# EAGLE design San1.3B2 Work (EAGLE 6.1)
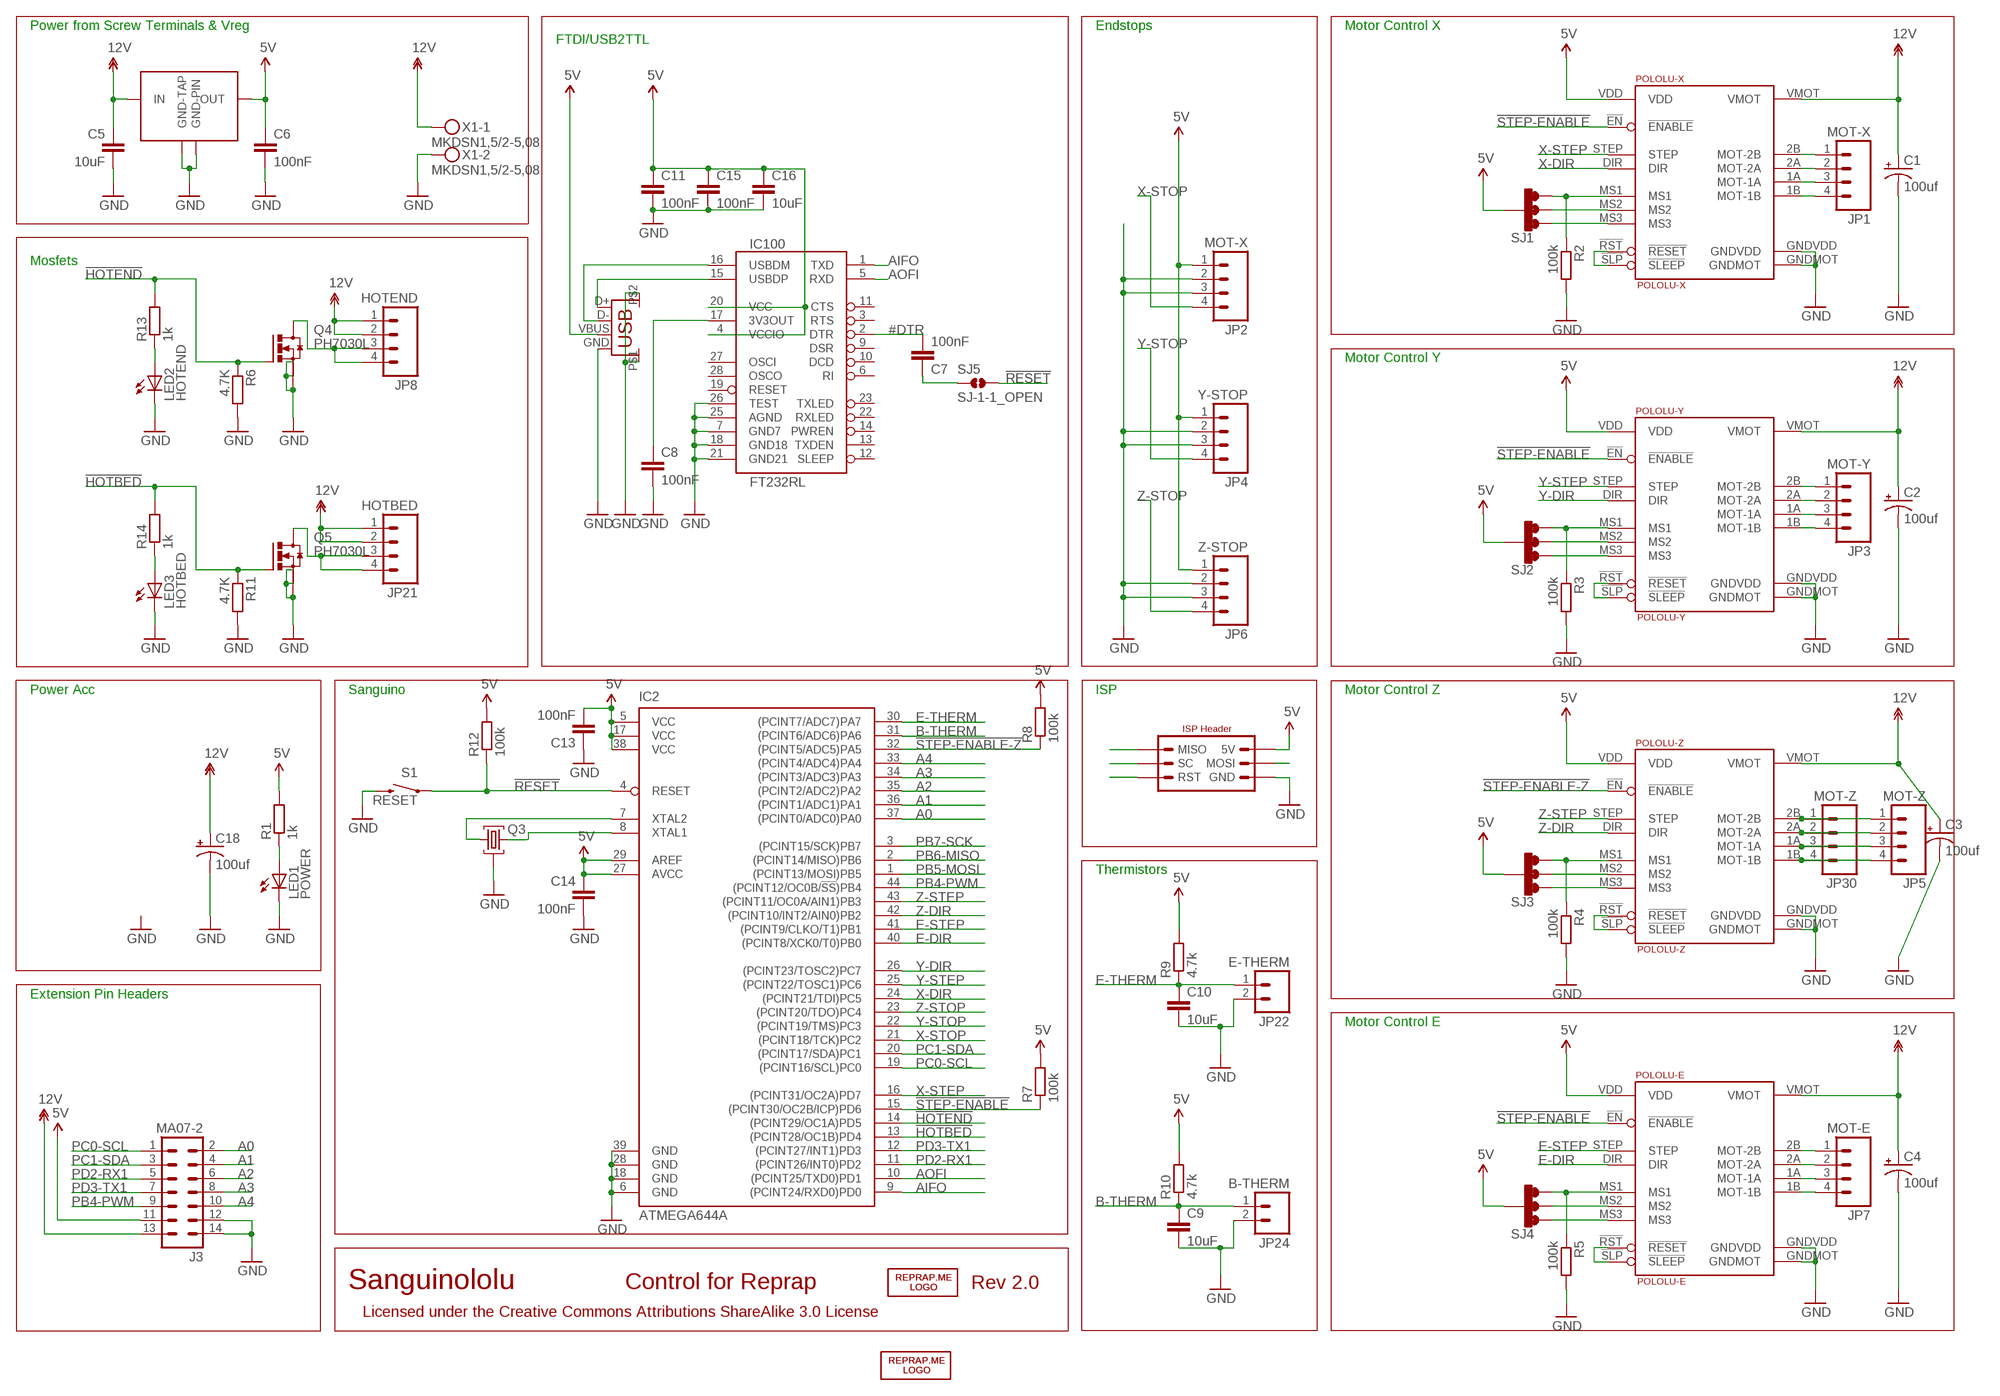
[diagram p0: schematic, sheet 1]

## Parts
C1  100uf  CAP_POLD  [PANASONIC_D]
C2  100uf  CAP_POLD  [PANASONIC_D]
C3  100uf  CAP_POLD  [PANASONIC_D]
C4  100uf  CAP_POLD  [PANASONIC_D]
C5  10uF  C-EU1206  [C1206]
C6  100nF  CAP0805  [0805]
C7  100nF  CAP0805  [0805]
C8  100nF  CAP0805  [0805]
C9  10uF  C-EU1206  [C1206]
C10  10uF  C-EU1206  [C1206]
C11  100nF  CAP0805  [0805]
C13  100nF  CAP0805  [0805]
C14  100nF  CAP0805  [0805]
C15  100nF  CAP0805  [0805]
C16  10uF  C-EU1206  [C1206]
C18  100uf  CAP_POLD  [PANASONIC_D]
IC1  V-REG+  [TO252+EXTRA-PIN]
IC2  ATMEGA644A  [TQFP44]
IC100  FT232RL  FT232RLSSOP  [SSOP28DB]
J1  USB  USBPTH  [USB-B-PTH]
J2  ISP-HEADER  [ISP-HEADER]
J3  MA07-2  [MA07-2]
JP1  MOT-X  M04POLAR  [MOLEX-1X4]
JP2  MOT-X  M04POLAR  [MOLEX-1X4]
JP3  MOT-Y  M04POLAR  [MOLEX-1X4]
JP4  Y-STOP  M04POLAR  [MOLEX-1X4]
JP5  MOT-Z  M04POLAR  [MOLEX-1X4]
JP6  Z-STOP  M04POLAR  [MOLEX-1X4]
JP7  MOT-E  M04POLAR  [MOLEX-1X4]
JP8  HOTEND  M04NO_THERMAL  [MOLEX-1X4_NO_THERMAL]
JP21  HOTBED  M04NO_THERMAL  [MOLEX-1X4_NO_THERMAL]
JP22  E-THERM  M02PTH  [1X02]
JP24  B-THERM  M02PTH  [1X02]
JP30  MOT-Z  M04POLAR  [MOLEX-1X4]
LED1  POWER  LEDCHIP-LED0805  [CHIP-LED0805]
LED2  HOTEND  LEDCHIP-LED0805  [CHIP-LED0805]
LED3  HOTBED  LEDCHIP-LED0805  [CHIP-LED0805]
LOGO1  REPRAP-LOGO6X100_BOTSILK  [REPRAP.ME_6X100_BOTSILK]
LOGO2  REPRAP-LOGO6X100_BOTSILK  [REPRAP.ME_6X100_BOTSILK]
LOGO3  REPRAP-LOGO6X100_TOPSILK  [REPRAP.ME_6X100_TOPSILK]
LOGO4  REPRAP-LOGO6X100_TOPSILK  [REPRAP.ME_6X100_TOPSILK]
POLOLU-E  POLOLU-E  POLOLU-ALLEGRO  [POLOLU-ALLEGRO-PTH]
POLOLU-X  POLOLU-X  POLOLU-ALLEGRO  [POLOLU-ALLEGRO-PTH]
POLOLU-Y  POLOLU-Y  POLOLU-ALLEGRO  [POLOLU-ALLEGRO-PTH]
POLOLU-Z  POLOLU-Z  POLOLU-ALLEGRO  [POLOLU-ALLEGRO-PTH]
Q3  AWSCR-CV  [AWSCR]
Q4  PH7030L  [SOT669-NO-THERMAL]
Q5  PH7030L  [SOT669-NO-THERMAL]
R1  1k  R-EU0805  [R0805]
R2  100k  R-EU0805  [R0805]
R3  100k  R-EU0805  [R0805]
R4  100k  R-EU0805  [R0805]
R5  100k  R-EU0805  [R0805]
R6  4.7K  R-EU0805  [R0805]
R7  100k  R-EU0805  [R0805]
R8  100k  R-EU0805  [R0805]
R9  4.7k  R-EU0805  [R0805]
R10  4.7k  R-EU0805  [R0805]
R11  4.7K  R-EU0805  [R0805]
R12  100k  R-EU0805  [R0805]
R13  1k  R-EU0805  [R0805]
R14  1k  R-EU0805  [R0805]
S1  RESET  SWITCH-MOMENTARY-2  [TACTILE_SWITCH_TALL]
SJ1  SJ-3  [SJ-3]
SJ2  SJ-3  [SJ-3]
SJ3  SJ-3  [SJ-3]
SJ4  SJ-3  [SJ-3]
SJ5  SJ-1-1_OPEN  [SJ-1-1_OPEN]
X1  MKDSN1,5/2-5,08  [MKDSN1,5/2-5,08]

## Nets
3V3: C8.1 IC100.17(3V3OUT)
5V [power]: C6.1 C11.1 C13.2 C14.1 C15.1 C16.1 IC1.2(OUT) IC2.5(VCC) IC2.17(VCC) IC2.27(AVCC) IC2.29(AREF) IC2.38(VCC) IC100.4(VCCIO) IC100.20(VCC) J1.VBUS J2.2(5V) J3.11 JP2.1 JP4.1 JP6.1 POLOLU-E.VDD POLOLU-X.VDD POLOLU-Y.VDD POLOLU-Z.VDD R1.2 R7.2 R8.2 R9.2 R10.2 R12.2 SJ1.4(COMMON) SJ2.4(COMMON) SJ3.4(COMMON) SJ4.4(COMMON)
12V [power]: C1.+ C2.+ C3.+ C4.+ C5.1 C18.+ IC1.1(IN) J3.13 JP8.1 JP8.2 JP21.1 JP21.2 POLOLU-E.VMOT POLOLU-X.VMOT POLOLU-Y.VMOT POLOLU-Z.VMOT X1.1
!FTDI-RESET: C7.1 SJ5.1
!HOTBED: IC2.13((PCINT28/OC1B)PD4) Q5.4(G) R11.1 R14.2
!HOTEND: IC2.14((PCINT29/OC1A)PD5) Q4.4(G) R6.1 R13.2
!RESET: IC2.4(RESET) J2.5(RST) R12.1 S1.A2 SJ5.2
!STEP-ENABLE: IC2.15((PCINT30/OC2B/ICP)PD6) POLOLU-E.!EN(!ENABLE) POLOLU-X.!EN(!ENABLE) POLOLU-Y.!EN(!ENABLE) R7.1
!STEP-ENABLE-Z: IC2.32((PCINT5/ADC5)PA5) POLOLU-Z.!EN(!ENABLE) R8.1
#DTR: C7.2 IC100.2(DTR)
A0: IC2.37((PCINT0/ADC0)PA0) J3.2
A1: IC2.36((PCINT1/ADC1)PA1) J3.4
A2: IC2.35((PCINT2/ADC2)PA2) J3.6
A3: IC2.34((PCINT3/ADC3)PA3) J3.8
A4: IC2.33((PCINT4/ADC4)PA4) J3.10
AIFO: IC2.9((PCINT24/RXD0)PD0) IC100.1(TXD)
AOFI: IC2.10((PCINT25/TXD0)PD1) IC100.5(RXD)
B-THERM: C9.1 IC2.31((PCINT6/ADC6)PA6) JP24.1 R10.1
E-DIR: IC2.40((PCINT8/XCK0/T0)PB0) POLOLU-E.DIR
E-MOT-1A [power]: JP7.3 POLOLU-E.1A(MOT-1A)
E-MOT-1B [power]: JP7.4 POLOLU-E.1B(MOT-1B)
E-MOT-2A [power]: JP7.2 POLOLU-E.2A(MOT-2A)
E-MOT-2B [power]: JP7.1 POLOLU-E.2B(MOT-2B)
E-MS1: POLOLU-E.MS1 R5.1 SJ4.3
E-MS2: POLOLU-E.MS2 SJ4.2
E-MS3: POLOLU-E.MS3 SJ4.1
E-RESETSLEEP: POLOLU-E.!RST(!RESET) POLOLU-E.!SLP(!SLEEP)
E-STEP: IC2.41((PCINT9/CLKO/T1)PB1) POLOLU-E.STEP
E-THERM: C10.1 IC2.30((PCINT7/ADC7)PA7) JP22.1 R9.1
GND [power]: C1.- C2.- C3.- C4.- C5.2 C6.2 C8.2 C9.2 C10.2 C11.2 C13.1 C14.2 C15.2 C16.2 C18.- IC1.3(GND-TAP) IC1.4(GND-PIN) IC2.6(GND) IC2.18(GND) IC2.28(GND) IC2.39(GND) IC100.7(GND7) IC100.18(GND18) IC100.21(GND21) IC100.25(AGND) IC100.26(TEST) J1.GND J1.P$1 J1.P$2 J2.6(GND) J3.12 J3.14 JP2.2 JP2.3 JP4.2 JP4.3 JP6.2 JP6.3 JP22.2 JP24.2 LED1.C LED2.C LED3.C POLOLU-E.GNDMOT POLOLU-E.GNDVDD POLOLU-X.GNDMOT POLOLU-X.GNDVDD POLOLU-Y.GNDMOT POLOLU-Y.GNDVDD POLOLU-Z.GNDMOT POLOLU-Z.GNDVDD Q3.GND Q4.1(S) Q4.2(S) Q4.3(S) Q5.1(S) Q5.2(S) Q5.3(S) R2.2 R3.2 R4.2 R5.2 R6.2 R11.2 S1.B2 X1.2
HOTBED-GND [power]: JP21.3 JP21.4 Q5.MB(D)
HOTEND-GND [power]: JP8.3 JP8.4 Q4.MB(D)
LED1: LED1.A R1.1
LED2: LED2.A R13.1
LED3: LED3.A R14.1
N$2: IC2.8(XTAL1) Q3.IN
N$3: IC2.7(XTAL2) Q3.OUT
PB4-PWM: IC2.44((PCINT12/OC0B/!SS!)PB4) J3.9
PB5-MOSI: IC2.1((PCINT13/MOSI)PB5) J2.4(MOSI)
PB6-MISO: IC2.2((PCINT14/MISO)PB6) J2.1(MISO)
PB7-SCK: IC2.3((PCINT15/SCK)PB7) J2.3(SC)
PC0-SCL: IC2.19((PCINT16/SCL)PC0) J3.1
PC1-SDA: IC2.20((PCINT17/SDA)PC1) J3.3
PD2-RX1: IC2.11((PCINT26/INT0)PD2) J3.5
PD3-TX1: IC2.12((PCINT27/INT1)PD3) J3.7
USBDM: IC100.16(USBDM) J1.D-
USBDP: IC100.15(USBDP) J1.D+
X-DIR: IC2.24((PCINT21/TDI)PC5) POLOLU-X.DIR
X-MOT-1A [power]: JP1.3 POLOLU-X.1A(MOT-1A)
X-MOT-1B [power]: JP1.4 POLOLU-X.1B(MOT-1B)
X-MOT-2A [power]: JP1.2 POLOLU-X.2A(MOT-2A)
X-MOT-2B [power]: JP1.1 POLOLU-X.2B(MOT-2B)
X-MS1: POLOLU-X.MS1 R2.1 SJ1.3
X-MS2: POLOLU-X.MS2 SJ1.2
X-MS3: POLOLU-X.MS3 SJ1.1
X-RESETSLEEP: POLOLU-X.!RST(!RESET) POLOLU-X.!SLP(!SLEEP)
X-STEP: IC2.16((PCINT31/OC2A)PD7) POLOLU-X.STEP
X-STOP: IC2.21((PCINT18/TCK)PC2) JP2.4
Y-DIR: IC2.26((PCINT23/TOSC2)PC7) POLOLU-Y.DIR
Y-MOT-1A [power]: JP3.3 POLOLU-Y.1A(MOT-1A)
Y-MOT-1B [power]: JP3.4 POLOLU-Y.1B(MOT-1B)
Y-MOT-2A [power]: JP3.2 POLOLU-Y.2A(MOT-2A)
Y-MOT-2B [power]: JP3.1 POLOLU-Y.2B(MOT-2B)
Y-MS1: POLOLU-Y.MS1 R3.1 SJ2.3
Y-MS2: POLOLU-Y.MS2 SJ2.2
Y-MS3: POLOLU-Y.MS3 SJ2.1
Y-RESETSLEEP: POLOLU-Y.!RST(!RESET) POLOLU-Y.!SLP(!SLEEP)
Y-STEP: IC2.25((PCINT22/TOSC1)PC6) POLOLU-Y.STEP
Y-STOP: IC2.22((PCINT19/TMS)PC3) JP4.4
Z-DIR: IC2.42((PCINT10/INT2/AIN0)PB2) POLOLU-Z.DIR
Z-MOT-1A [power]: JP5.3 JP30.3 POLOLU-Z.1A(MOT-1A)
Z-MOT-1B [power]: JP5.4 JP30.4 POLOLU-Z.1B(MOT-1B)
Z-MOT-2A [power]: JP5.2 JP30.2 POLOLU-Z.2A(MOT-2A)
Z-MOT-2B [power]: JP5.1 JP30.1 POLOLU-Z.2B(MOT-2B)
Z-MS1: POLOLU-Z.MS1 R4.1 SJ3.3
Z-MS2: POLOLU-Z.MS2 SJ3.2
Z-MS3: POLOLU-Z.MS3 SJ3.1
Z-RESETSLEEP: POLOLU-Z.!RST(!RESET) POLOLU-Z.!SLP(!SLEEP)
Z-STEP: IC2.43((PCINT11/OC0A/AIN1)PB3) POLOLU-Z.STEP
Z-STOP: IC2.23((PCINT20/TDO)PC4) JP6.4
Unconnected: IC100.3(RTS) IC100.6(RI) IC100.9(DSR) IC100.10(DCD) IC100.11(CTS) IC100.12(SLEEP) IC100.13(TXDEN) IC100.14(PWREN) IC100.19(RESET) IC100.22(RXLED) IC100.23(TXLED) IC100.27(OSCI) IC100.28(OSCO)

## Notes on the sheet
- Power from Screw Terminals & Vreg | Endstops | Motor Control X
- FTDI/USB2TTL
- Mosfets
- Motor Control Y
- Power Acc | Sanguino | ISP | Motor Control Z
- Thermistors
- Extension Pin Headers
- Motor Control E
- Sanguinololu | Control for Reprap | Rev 2.0
- Licensed under the Creative Commons Attributions ShareAlike 3.0 License

## Library data of the parts
C1-C4 C18 = SparkFun:CAP_POL: Capacitor Polarized These are standard SMD and PTH capacitors. Normally 10uF, 47uF, and 100uF in electrolytic and tantalum varieties. Always verify the external diameter of the through hole cap, it varies with capacity, voltage, and manufacturer. The EIA devices should be standard.
C5 C9 C10 C16 = REPRAP_ME:C-EU
C6-C8 C11 C13-C15 = SparkFun:CAP: Capacitor Standard 0603 ceramic capacitor, and 0.1" leaded capacitor.
IC1 = REPRAP_ME:V-REG+
IC2 = atmel:ATMEGA644: 8-bit Microcontroller with 64K Bytes In-System Programmable Flash Source: http://www.atmel.com/dyn/resources/prod_documents/doc2593.pdf; MPN: ATMEGA644PV-10AU; OC_FARNELL: 1455123; OC_NEWARK: 58M3748
IC100 = SparkFun:FT232RL: USB UART FT232RL 4th Generation USB UART (USB <-> Serial) Controller. Spark Fun Electronics SKU : COM-00650
J1 = SparkFun:USB: USB Connectors USB-B-PTH is fully proven SKU : PRT-00139 USB-miniB is fully proven SKU : PRT-00587 USB-A-PCB is untested. USB-A-H is throughly reviewed, but untested. Spark Fun Electronics SKU : PRT-00437 USB-B-SMT is throughly reviewed, but untested. Needs silkscreen touching up. USB-A-S has not been used/tested USB-MB-H has not been used/tested
J2 = REPRAP_ME:ISP-HEADER: PIN HEADER; OC_FARNELL: unknown; OC_NEWARK: unknown
J3 = Header Male:MA07-2: PIN HEADER; OC_FARNELL: unknown; OC_NEWARK: unknown
JP1-JP7 JP30 = SparkFun:M04: Header 4 Standard 4-pin 0.1" header. Use with straight break away headers (SKU : PRT-00116), right angle break away headers (PRT-00553), swiss pins (PRT-00743), machine pins (PRT-00117), and female headers (PRT-00115). Molex polarized connector foot print use with SKU : PRT-08231 with associated ...
JP8 JP21 = REPRAP_ME:M04: Header 4 Standard 4-pin 0.1" header. Use with straight break away headers (SKU : PRT-00116), right angle break away headers (PRT-00553), swiss pins (PRT-00743), machine pins (PRT-00117), and female headers (PRT-00115). Molex polarized connector foot print use with SKU : PRT-08231 with associated ...
JP22 JP24 = SparkFun:M02: Header 2 Standard 2-pin 0.1" header. Use with straight break away headers (SKU : PRT-00116), right angle break away headers (PRT-00553), swiss pins (PRT-00743), machine pins (PRT-00117), and female headers (PRT-00115). Molex polarized connector foot print use with SKU : PRT-08233 with associated crimp pins and housings.
LED1-LED3 = led:LED: LED OSRAM: - CHIPLED LG R971, LG N971, LY N971, LG Q971, LY Q971, LO R971, LY R971 LH N974, LH R974 LS Q976, LO Q976, LY Q976 LO Q996 - Hyper CHIPLED LW Q18S LB Q993, LB Q99A, LB R99A - SideLED LS A670, LO A670, LY A670, LG A670, LP A670 LB A673, LV A673, LT A673, LW A673 LH A674 LY A675 LS A676, LA A676, LO A676, LY A676, LW A676 LS A679, LY A679, LG A679 - Hyper Micro SIDELED® LS Y876, LA Y876, LO Y876, LY Y876 LT Y87S - SmartLED LW L88C, LW L88S LB L89C, LB L89S, LG L890 LS L89K, LO L89K, LY L89K LS L896, LA L896, LO L896, LY L896 - TOPLED LS T670, LO T670, LY T670, LG T670, LP T670 LSG T670, LSP T670, LSY T670, LOP T670, LYG T670 LG T671, LOG T671, LSG T671 LB T673, LV T673, LT T673, LW T673 LH T674 LS T676, LA T676, LO T676, LY T676, LB T676, LH T676, LSB T676, LW T676 LB T67C, LV T67C, LT T67C, LS T67K, LO T67K, LY T67K, LW E67C LS E67B, LA E67B, LO E67B, LY E67B, LB E67C, LV E67C, LT E67C LW T67C LS T679, LY T679, LG T679 LS T770, LO T770, LY T770, LG T770, LP T770 LB T773, LV T773, LT T773, LW T773 LH T774 LS E675, LA E675, LY E675, LS T675 LS T776, LA T776, LO T776, LY T776, LB T776 LHGB T686 LT T68C, LB T68C - Hyper Mini TOPLED® LB M676 - Mini TOPLED Santana® LG M470 LS M47K, LO M47K, LY M47K Source: http://www.osram.convergy.de LUXEON: - LUMILED® LXK2-PW12-R00, LXK2-PW12-S00, LXK2-PW14-U00, LXK2-PW14-V00 LXK2-PM12-R00, LXK2-PM12-S00, LXK2-PM14-U00 LXK2-PE12-Q00, LXK2-PE12-R00, LXK2-PE12-S00, LXK2-PE14-T00, LXK2-PE14-U00 LXK2-PB12-K00, LXK2-PB12-L00, LXK2-PB12-M00, LXK2-PB14-N00, LXK2-PB14-P00, LXK2-PB14-Q00 LXK2-PR12-L00, LXK2-PR12-M00, LXK2-PR14-Q00, LXK2-PR14-R00 LXK2-PD12-Q00, LXK2-PD12-R00, LXK2-PD12-S00 LXK2-PH12-R00, LXK2-PH12-S00 LXK2-PL12-P00, LXK2-PL12-Q00, LXK2-PL12-R00 Source: www.luxeon.com KINGBRIGHT: KA-3528ASYC Source: www.kingbright.com
LOGO1-LOGO4 = REPRAP_ME:REPRAP-LOGO
POLOLU-E POLOLU-X POLOLU-Y POLOLU-Z = pololu-allegro:POLOLU-ALLEGRO
Q3 = REPRAP_ME:AWSCR-CV
Q4 Q5 = REPRAP_ME:PH7030L: N-channel TrenchMOS (TM) logic level FET Source: http://www.nxp.com/acrobat_download/datasheets/PH7030L_4.pdf
R1-R14 = REPRAP_ME:R-EU
S1 = printrbot:SWITCH-MOMENTARY-2
SJ1-SJ4 = REPRAP_ME:SJ-3: SMD solder JUMPER
SJ5 = REPRAP_ME:SJ-1-1_OPEN
X1 = con-phoenix-508:MKDSN1,5/2-5,08: MKDSN 1,5/ 2-5,08 Printklemme Nennstrom: 13,5 A Nennspannung: 250 V Rastermaß: 5,08 mm Polzahl: 2 Anschlussart: Schraubanschluss Montage: Löten Anschlussrichtung Leiter/Platine: 0 ° Artikelnummer: 1729128 Source: http://eshop.phoenixcontact.com .. 1729128.pdf; MPN: MKDSN 1,5/2-5.08; OC_FARNELL: 1792903; OC_NEWARK: 30M2397

## Net classes
1 power: width 1.27 mm

## Board
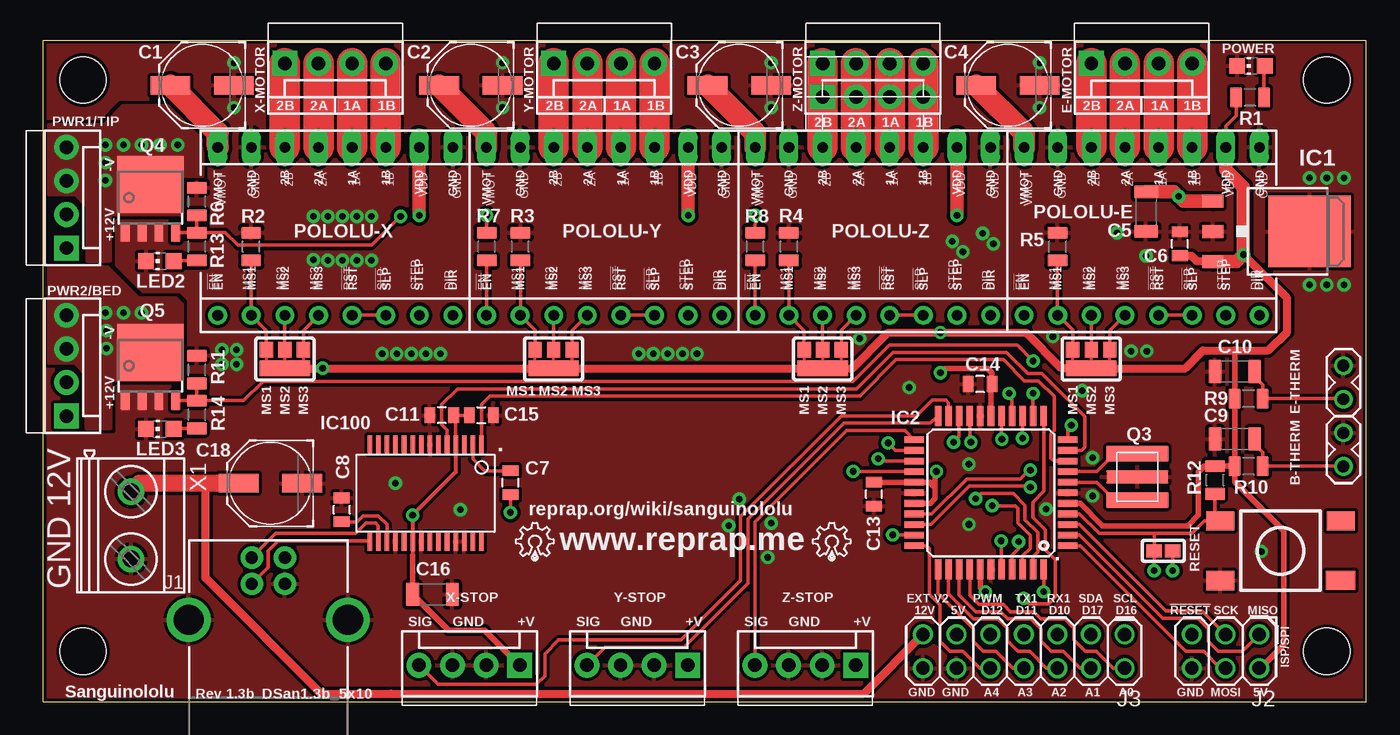
[diagram p1: board, top side]
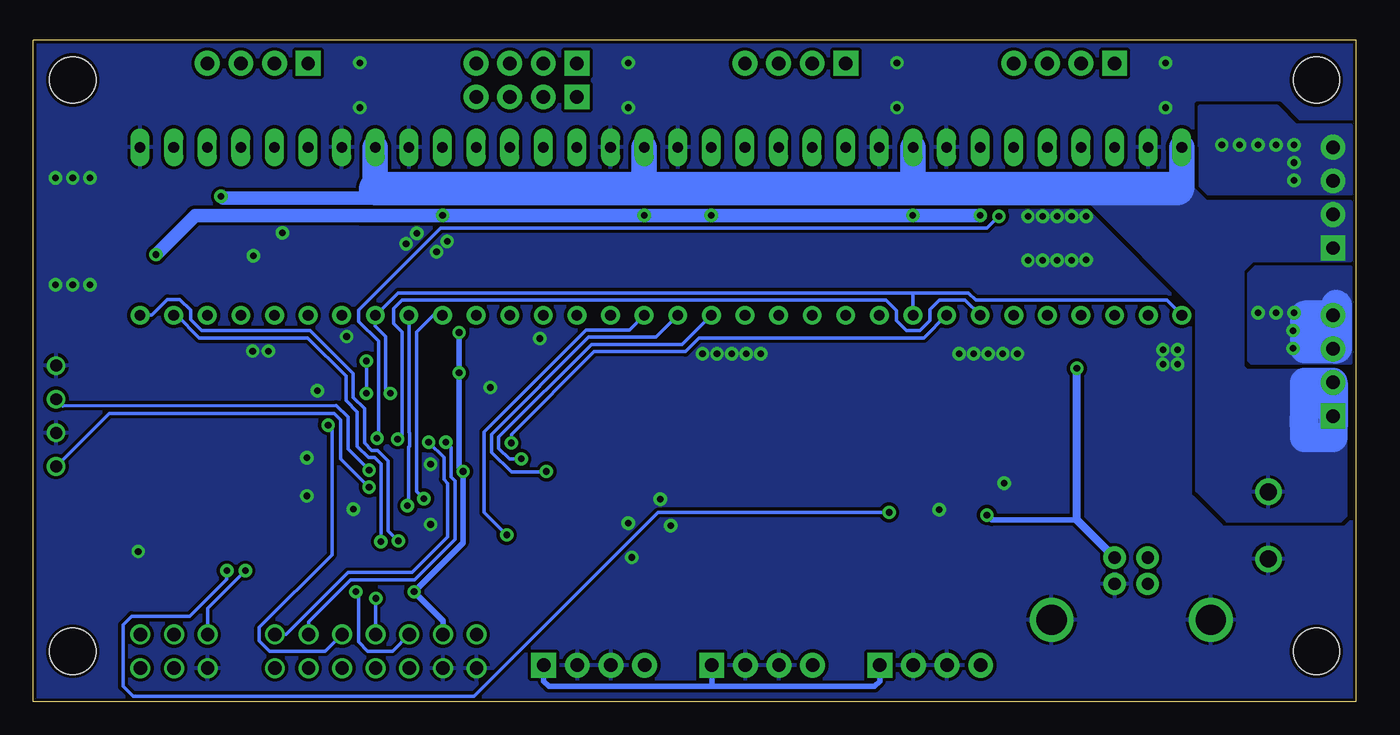
[diagram p2: board, bottom side, seen from below]

Size 100 x 50 mm. Coordinates in mm from the lower left corner, seen from the top.
Outline: 0,0 0,50 100,50 100,0 0,0
Copper layers (1*16): Top 0.035mm / dielectric 1.5mm / Bottom 0.035mm
Design rules "default": minimum track width 10mil, minimum drill 0.5mm, track to track 0.25mm, track to pad 10mil, pad to pad 10mil, via to via 10mil, smd to smd 10mil, copper to edge 10mil, drill to drill 10mil, minimum pad ring 10mil, minimum via ring 10mil, stop-mask expansion 4mil, vias tented up to drill 0.5mm, thermal gap 10mil
Holes 3.5 mm at 3,47 97,47 97,3.8 3,3.8

### Footprints (pad centres in the part's own frame; a part is rotated, then mirrored left to right if it is on the bottom)
PANASONIC_D = smd 3 x 1.4: + 2.4,0; - -2.4,0
C1206 = smd 1 x 1.8: 1 -1.5,0; 2 1.5,0
0805 = smd 0.8 x 1.2: 1 -0.9,0; 2 0.9,0
TO252+EXTRA-PIN = smd 1 x 1.6: 1 -2.28,-4.8; 2 2.28,-4.8; 4 0.02,-4.8 | smd 5.4 x 6.2: 3 0,2.5
TQFP44 = smd 1.5 x 0.5: 1 -5.8,4; 2 -5.8,3.2; 3 -5.8,2.4; 4 -5.8,1.6; 5 -5.8,0.8; 6 -5.8,0; 7 -5.8,-0.8; 8 -5.8,-1.6; 9 -5.8,-2.4; 10 -5.8,-3.2; 11 -5.8,-4; 23 5.8,-4; 24 5.8,-3.2; 25 5.8,-2.4; 26 5.8,-1.6; 27 5.8,-0.8; 28 5.8,0; 29 5.8,0.8; 30 5.8,1.6; 31 5.8,2.4; 32 5.8,3.2; 33 5.8,4 | smd 0.5 x 1.5: 12 -4,-5.8; 13 -3.2,-5.8; 14 -2.4,-5.8; 15 -1.6,-5.8; 16 -0.8,-5.8; 17 0,-5.8; 18 0.8,-5.8; 19 1.6,-5.8; 20 2.4,-5.8; 21 3.2,-5.8; 22 4,-5.8; 34 4,5.8; 35 3.2,5.8; 36 2.4,5.8; 37 1.6,5.8; 38 0.8,5.8; 39 0,5.8; 40 -0.8,5.8; 41 -1.6,5.8; 42 -2.4,5.8; 43 -3.2,5.8; 44 -4,5.8
SSOP28DB = smd 0.348 x 1.397: 1 -4.225,-3.656; 2 -3.575,-3.656; 3 -2.925,-3.656; 4 -2.275,-3.656; 5 -1.625,-3.656; 6 -0.975,-3.656; 7 -0.325,-3.656; 8 0.325,-3.656; 9 0.975,-3.656; 10 1.625,-3.656; 11 2.275,-3.656; 12 2.925,-3.656; 13 3.575,-3.656; 14 4.225,-3.656; 15 4.225,3.656; 16 3.575,3.656; 17 2.925,3.656; 18 2.275,3.656; 19 1.625,3.656; 20 0.975,3.656; 21 0.325,3.656; 22 -0.325,3.656; 23 -0.975,3.656; 24 -1.625,3.656; 25 -2.275,3.656; 26 -2.925,3.656; 27 -3.575,3.656; 28 -4.225,3.656
USB-B-PTH = drill 0.914 pad 1.676: D+ 0,1.25; D- 1.981,1.25; GND 0,-1.25; VBUS 1.981,-1.25 | drill 2.286: P$1 -2.718,-6.02; P$2 -2.718,6.02
ISP-HEADER = drill 1: 1 -2.54,-1.27; 2 -2.54,1.27; 3 0,-1.27; 4 0,1.27; 5 2.54,-1.27; 6 2.54,1.27
MA07-2 = drill 1: 1 -7.62,-1.27; 2 -7.62,1.27; 3 -5.08,-1.27; 4 -5.08,1.27; 5 -2.54,-1.27; 6 -2.54,1.27; 7 0,-1.27; 8 0,1.27; 9 2.54,-1.27; 10 2.54,1.27; 11 5.08,-1.27; 12 5.08,1.27; 13 7.62,-1.27; 14 7.62,1.27
MOLEX-1X4 = drill 1.016 pad 1.88 square: 1 0,0 | drill 1.016 pad 1.88: 2 2.54,0; 3 5.08,0; 4 7.62,0
MOLEX-1X4_NO_THERMAL = drill 1.016 pad 1.88 square: 1 0,0 | drill 1.016 pad 1.88: 2 2.54,0; 3 5.08,0; 4 7.62,0
1X02 = drill 0.9: 1 0,0; 2 2.54,0
CHIP-LED0805 = smd 1.2 x 1.2: A 0,-1.05; C 0,1.05
POLOLU-ALLEGRO-PTH = drill 0.8 pad 1.422 long: 1A 6.35,-1.27; 1B 6.35,-3.81; 2A 6.35,1.27; 2B 6.35,3.81; GNDMOT 6.35,6.35; GNDVDD 6.35,-8.89; VDD 6.35,-6.35; VMOT 6.35,8.89 | drill 0.8 pad 1.422: !EN -6.35,8.89; !RST -6.35,-1.27; !SLP -6.35,-3.81; DIR -6.35,-8.89; MS1 -6.35,6.35; MS2 -6.35,3.81; MS3 -6.35,1.27; STEP -6.35,-6.35
AWSCR = smd 1 x 4.7: GND 0,0 | smd 1.2 x 4.7: IN -1.75,0; OUT 1.75,0
SOT669-NO-THERMAL = smd 0.7 x 1.4: 1 -1.905,-2.65; 2 -0.635,-2.65; 3 0.635,-2.65; 4 1.905,-2.65 | smd 5 x 4.3: MB 0,1
R0805 = smd 0.9 x 1.5: 1 -1.05,0; 2 1.05,0
TACTILE_SWITCH_TALL = smd 2.1 x 1.45: A1 -4.55,-2.25; A2 4.55,-2.25; B2 4.55,2.25 | smd 2.25 x 1.45: B1 -4.55,2.225
SJ-3 = smd 1 x 1.2: 1 -1.4,-0.7; 2 0,-0.7; 3 1.4,-0.7 | smd 3.8 x 1.2: 4 0,0.7
SJ-1-1_OPEN = smd 1 x 1.2: 1 0,0.7; 2 0,-0.7
MKDSN1,5/2-5,08 = drill 1.3 pad 2: 1 -2.561,0.025; 2 2.519,0.025

### Placement (x,y rotation side)
C1  12,46.6 180 top
C2  32.3,46.6 180 top
C3  52.6,46.6 180 top
C4  72.9,46.6 180 top
C5  83.34,37.04 270 top
C6  85.89,34.62 90 top
C7  35.3,16.55 90 top
C8  22.55,14.5 90 top
C9  90.05,19.85 180 top
C10  90.05,24.95 180 top
C11  30.1,21.65 180 top
C13  62.77,15.69 90 top
C14  70.8,24 180 top
C15  33.1,21.65 0 top
C16  29.4,8.1 0 top
C18  17.15,16.5 180 top
IC1  93.2,35.55 270 top
IC2  71.61,15.79 180 top
IC100  28.89,15.75 180 top
J1  17,8.9 90 top
J2  89.35,3.8 180 top
J3  74.1,3.8 180 top
JP1  18.25,48.26 0 top
JP2  36,2.75 180 top
JP3  38.57,48.26 0 top
JP4  48.7,2.75 180 top
JP5  58.89,48.26 0 top
JP6  61.4,2.75 180 top
JP7  79.21,48.26 0 top
JP8  1.74,34.29 90 top
JP21  1.74,21.59 90 top
JP22  98.26,22.86 90 top
JP24  98.26,17.78 90 top
JP30  58.89,45.72 0 top
LED1  91.28,48.06 90 top
LED2  8.8,33.3 90 top
LED3  8.8,20.6 90 top
LOGO1  55.6,16.8 0 top
LOGO2  24.85,16.8 0 top
LOGO3  59.6,12.1 0 top
LOGO4  37.15,12.1 0 top
POLOLU-E  83.02,35.56 90 top
POLOLU-X  22.06,35.56 90 top
POLOLU-Y  42.38,35.56 90 top
POLOLU-Z  62.7,35.56 90 top
Q3  82.68,16.99 270 top
Q4  8.09,38.1 0 top
Q5  8.09,25.4 0 top
R1  91.2,45.69 180 top
R2  15.7,34.4 90 top
R3  36.05,34.4 90 top
R4  56.35,34.4 90 top
R5  76.65,34.4 90 top
R6  11.6,37.8 90 top
R7  33.5,34.4 90 top
R8  53.8,34.4 90 top
R9  91.1,22.9 180 top
R10  91.1,17.8 180 top
R11  11.6,25.1 90 top
R12  88.55,16.75 90 top
R13  11.6,34.4 90 top
R14  11.6,21.7 90 top
S1  93.5,11.4 180 top
SJ1  18.25,25.9 180 top
SJ2  38.55,25.9 180 top
SJ3  58.9,25.9 180 top
SJ4  79.2,25.9 180 top
SJ5  84.65,11.4 270 top
X1  6.6,13.3 270 top

### Tracks (layer width: path | path; a pad name or v marks a point on that pad's centre or on a via)
3V3
  Top 0.254: IC100.17 25.96,13.39 25.3,14.05 24.15,14.05 23.7,13.6 C8.1
5V  (via drill 0.5)
  Top 0.254: R7.2 v33.49,36.74 v33.5,36.75 | R8.2 v53.81,36.74 v53.8,36.75 | POLOLU-E.VDD 89.37,43.52 90.15,44.3 R1.2 | IC100.4 31.16,21.49 C11.1 C15.1
  Top 0.305: IC100.4 31.16,17.36 v27.9,14.1 27.9,12.1 IC100.20 27.91,11.05
  Top 0.406: C13.2 IC2.27 67.02,16.59 67.4,16.2 | IC2.38 70.81,8.59 v71.2,8.3 | IC2.29 67.03,14.98 67.4,15.35 67.4,16.2 | v67.5,17.4 67.4,17.3 67.4,16.2 | IC2.5 78.36,14.98 80.05,13.3 86.5,13.3 87.3,14.1 87.3,17.35 87.75,17.8 R12.2 90,17.8 | IC2.17 71.61,23.64 C14.1 71.7,24.85 71.35,25.2 68.15,25.2 v67.8,24.85 | 90.05,26.55 R9.2 R10.2 90,17.8 | J2.2 91.98,2.53 93.75,4.3 93.75,12.9 90.05,16.6 90.05,17.75 90,17.8 | 27.91,11.05 C16.1 28.01,8 | C16.1 28.01,8 | 28.01,8 30.61,5.4 33.35,5.4 JP2.1
  Top 0.61: SJ1.4 v21.1,25.2 SJ2.4 SJ3.4 61.15,25.2 63.85,27.9 v67.8,27.9 74.25,27.9 76.95,25.2 SJ4.4 86.3,25.2 87.65,26.55 90.05,26.55 92.6,26.55 94,27.95 94,30.5 v90.7,33.8 | C6.1 86.78,33.72 87.23,33.27 IC1.2
  Top 1.016: v28.4,36.75 v28.41,36.76 POLOLU-X.VDD | POLOLU-Y.VDD 48.73,36.75 v48.75,36.75 | POLOLU-Z.VDD v69.05,36.75 | POLOLU-E.VDD 89.37,40.23 90.7,38.9 v90.7,33.8 90.15,33.25 88.42,33.25 IC1.2
  Bottom 0.406: J3.11 69.02,6.12 v71.2,8.3 67.5,12 v67.5,17.4 67.8,17.7 v67.8,24.85 v67.8,27.9 | JP6.1 61.4,1.55 61,1.15 48.7,1.15 | 48.7,1.15 36.4,1.15 36,1.55 JP2.1 | JP4.1 48.7,1.15 | 21.1,13.73 27.53,13.73 v27.9,14.1
  Bottom 0.61: 75.35,36.75 75.4,36.75 | J1.VBUS 21.1,13.73 v21.1,25.2
  Bottom 1.016: v28.4,36.75 v33.5,36.75 v48.75,36.75 v53.8,36.75 v69.05,36.75 75.35,36.75 87.75,36.75 v90.7,33.8
12V  (via drill 0.5)
  Top 0.406: 26.3,0.65 26.25,0.6
  Top 0.61: J3.13 62.01,0.6 26.25,0.6 21,0.6 12.25,9.35 12.25,16.5
  Top 1.016: IC1.1 86.17,37.83 v85.8,38.2 85.46,38.54 C5.1
  Top 1.27: C18.+ 12.25,16.5 7.28,16.5 X1.1
  Top 1.676: POLOLU-Y.VMOT 33.49,43.01 C2.+ | POLOLU-Z.VMOT 53.81,42.99 C3.+ | POLOLU-E.VMOT 74.13,42.97 C4.+ | POLOLU-X.VMOT 13.17,43.03 C1.+
  Bottom 1.016: 74.13,38.83 74.15,38.83 | 74.15,38.83 74.15,38.85 | 74.15,38.83 74.15,38.1 74.1,38.05 85.65,38.05 v85.8,38.2
  Bottom 1.93: POLOLU-E.VMOT 74.13,38.83 74.1,38.8 | POLOLU-Z.VMOT 53.81,39.16 53.45,38.8 | POLOLU-Y.VMOT 33.49,38.89 33.4,38.8 | POLOLU-X.VMOT 13.17,38.87
  Bottom 2.184: JP21.2 JP21.1 1.75,19.95 3.89,19.94 3.9,21.64 3.9,24.13 JP21.2
  Bottom 2.54: 74.1,38.8 53.45,38.8 33.4,38.8 13.5,38.8
  pour Bottom: 0.4,37.8 0.4,33.35 7.85,33.35 8.6,32.6 8.6,25.35 8.3,25.05 3.4,25.05 3.4,22.7 0.8,22.7 0.8,14.05 1.2,13.65 9.7,13.65 12,15.95 12,29.65 20.1,37.75 14,39.05 12.6,39.05 11.35,37.8
!FTDI-RESET  (via drill 0.5)
  Top 0.254: C7.1 v35.3,14.3 | v85.35,9.9 SJ5.1
  Bottom 0.254: v35.3,14.3 52.75,14.3 66.65,0.4 92.45,0.4 93.2,1.15 93.2,5.8 92.55,6.45 88.15,6.45 85.35,9.25 v85.35,9.9
!HOTBED  (via drill 0.5)
  Top 0.254: Q5.4 R14.2 | R14.2 R11.1 | R14.2 15.15,22.75 16.6,24.2 61.2,24.2 63.95,26.95 73.6,26.95 v74.8,25.75 | v74.8,23.3 IC2.13
  Bottom 0.254: v74.8,25.75 v74.8,23.3
!HOTEND  (via drill 0.5)
  Top 0.254: Q4.4 R13.2 | R6.1 R13.2 | R13.2 13.75,35.45 14.7,34.5 24.8,34.5 v27,36.7 | IC2.14 74,21.57 v74,19.9
  Bottom 0.254: v27,36.7 27.9,35.8 69.2,35.8 75.4,29.6 75.4,28.75 73.9,27.25 73.9,20 v74,19.9
!RESET  (via drill 0.5)
  Top 0.254: IC2.4 78.31,14.19 79.8,12.7 83.95,12.7 | 83.95,12.7 86.8,12.7 87.75,13.65 S1.A2 88.55,14.05 R12.1 | 83.95,12.7 SJ5.2 v83.95,9.9
  Bottom 0.254: J2.5 86.81,7.04 v83.95,9.9
!STEP-ENABLE  (via drill 0.5)
  Top 0.254: R7.1 33.5,29.25 33.49,29.24 POLOLU-Y.!EN | IC2.15 73.22,23.09 v73,23.3
  Bottom 0.254: POLOLU-X.!EN 14.31,30.35 28.75,30.35 29.3,30.9 33.5,30.9 | POLOLU-Y.!EN 33.5,30.9 | 33.5,30.9 72.4,30.9 74.1,29.2 74.11,29.21 POLOLU-E.!EN 74.13,28.38 73.35,27.6 73.35,23.65 v73,23.3
!STEP-ENABLE-Z  (via drill 0.5)
  Top 0.254: R8.1 53.8,29.25 53.81,29.24 POLOLU-Z.!EN | IC2.32 64.22,12.59 v64.2,12.6
  Bottom 0.254: POLOLU-Z.!EN 54.92,28.1 58.2,28.1 65.9,20.4 65.9,14.3 v64.2,12.6
#DTR
  Top 0.254: IC100.2 32.46,18.34 33.35,17.45 C7.2
A0
  Top 0.254: J3.2 80.87,2.53 79.6,3.8 78.75,3.8 77.9,4.65 77.9,5.55 77.2,6.25 75.4,6.25 74.85,6.8 73.1,6.8 72.55,7.35 70.7,7.35 70.02,8.04 IC2.37
A1
  Top 0.254: J3.4 78.37,2.53 77.1,3.8 76.2,3.8 75.4,4.6 75.4,5.5 74.65,6.25 72.9,6.25 72.35,6.8 70.5,6.8 69.22,8.09 IC2.36
A2
  Top 0.254: J3.6 75.82,2.53 74.55,3.8 73.65,3.8 72.85,4.6 72.85,5.55 72.15,6.25 70.3,6.25 68.42,8.13 IC2.35
A3
  Top 0.254: J3.8 73.27,2.53 72,3.8 71.05,3.8 70.3,4.55 70.3,5.5 67.61,8.19 IC2.34
A4
  Top 0.254: J3.10 70.77,2.53 69.5,3.8 68.5,3.8 67.75,4.55 67.75,7.3 66.95,8.1 66.95,11.6 66.77,11.79 IC2.33
AIFO
  Top 0.254: IC100.1 33.11,22.46 33.75,23.1 61.7,23.1 64.45,25.85 72.55,25.85 74.15,24.25 75.2,24.25 76.4,23.05 76.4,20.5 76.15,20.25 76.15,18.4 76.36,18.18 IC2.9
AOFI
  Top 0.254: IC100.5 30.51,20.54 30.1,20.95 30.1,22.45 31.3,23.65 61.45,23.65 64.2,26.4 72.8,26.4 74.4,24.8 75.45,24.8 78.7,21.55 78.7,19.25 78.44,18.98 IC2.10
B-THERM  (via drill 0.5)
  Top 0.254: IC2.31 67.08,13.38 70,16.3 74.5,16.3 v74.6,16.2 | JP24.1 98.24,17.8 R10.1 92.15,18.85 91.8,19.2 91.8,19.6 C9.1
  Bottom 0.254: v74.6,16.2 76.75,18.35 76.75,21.3 77.25,21.8 94.25,21.8 JP24.1
E-DIR  (via drill 0.5)
  Top 0.254: IC2.40 72.42,12.13 v72.4,12.15
  Bottom 0.254: POLOLU-E.DIR 91.04,29.21 89.85,30.4 88.9,30.4 88.1,29.6 88.1,28.9 87.25,28.05 79.05,28.05 75.8,24.8 75.8,23 74.95,22.15 74.95,19.55 74.4,19 73.95,19 73.15,18.2 73.15,12.9 v72.4,12.15
E-MOT-1A
  Top 2.286: POLOLU-E.1A JP7.3
E-MOT-1B
  Top 2.286: POLOLU-E.1B JP7.4
E-MOT-2A
  Top 2.286: POLOLU-E.2A JP7.2
E-MOT-2B
  Top 2.286: POLOLU-E.2B JP7.1
E-MS1
  Top 0.254: SJ4.3 77.8,28.08 POLOLU-E.MS1 76.65,29.2 R5.1
E-MS2
  Top 0.254: SJ4.2 79.21,26.56 POLOLU-E.MS2
E-MS3
  Top 0.254: SJ4.1 80.6,28.06 POLOLU-E.MS3
E-RESETSLEEP
  Top 0.254: POLOLU-E.!RST POLOLU-E.!SLP
E-STEP  (via drill 0.5)
  Top 0.254: IC2.41 73.22,11.06 73.7,11.55 v73.7,12.1
  Bottom 0.254: POLOLU-E.STEP 89.16,29.21 87.45,27.5 79.25,27.5 76.35,24.6 76.35,22.75 75.5,21.9 75.5,19.3 74.65,18.45 74.2,18.45 73.7,17.95 v73.7,12.1
E-THERM  (via drill 0.5)
  Top 0.254: IC2.30 67.14,14.19 69.8,16.85 73.85,16.85 74.5,17.5 v74.6,17.5 | JP22.1 98.22,22.9 R9.1 92.15,23.95 91.55,24.55 C10.1
  Bottom 0.254: v74.6,17.5 76.2,19.1 76.2,21.5 77.1,22.4 97.75,22.35 JP22.1
GND  (via drill 0.5)
  other vias: 14.6,26.6 13.5,26.6 13.5,25.5 14.6,25.5 20.4,36.7 21.5,36.7 22.6,36.7 23.7,36.7 24.8,36.7 24.8,33.35 23.7,33.35 22.6,33.35 21.5,33.35 20.4,33.4 30,26.3 28.9,26.3 27.8,26.3 26.7,26.3 25.6,26.3 31.5,14.5 26.6,16.5 55,48.3 71,35.4 68.7,34.8 71.8,34.6 69.5,34 65.45,23.75 75.8,14.55 69.95,13.4 69.95,17.95 76.3,27.6 78.5,23.5 79.3,18.45 79.3,15.55 49.4,26.3 48.3,26.3 47.2,26.3 46.1,26.3 45,26.3 61.7,27.45 55,13.5 54.75,10.9 51.8,13.3 52.6,15.3 92.05,11.35 14.4,48.3 14.4,44.9 34.7,48.3 34.7,44.9 75.3,48.3 55,44.9 75.3,44.9 81.15,35.45 83.35,33.7 95.7,39.6 98.3,39.6 97,39.6 95.7,31.5 97,31.5 98.3,31.5 82.2,26.5 83.4,26.5
  pour Top (rank 6): 0,0 0,50 100,50 100,0
  pour Bottom (rank 6): 0,0 0,50 100,50 100,0
HOTBED-GND  (via drill 0.5)
  Bottom 2.184: JP21.3 JP21.4 3.9,29.21 3.9,26.67 JP21.3 | JP21.3 1.43,26.67 1.4,26.7 1.4,29.95 1.5,30.05
  other vias: 7.4,29.4 6.05,29.4 4.7,29.4 4.75,28.05 4.75,26.7
  pour Top: 10.5,24.3 5.1,24.3 5.1,20.65 3.25,20.65 3.25,24.7 2.35,25.6 0.4,25.6 0.4,32.85 4.85,32.85 7.2,30.5 10.05,30.5 10.5,30.05
  pour Bottom: 0.4,25.6 7.9,25.6 8.1,25.8 8.1,32.35 7.6,32.85 0.4,32.85
HOTEND-GND  (via drill 0.5)
  other vias: 7.4,42.1 8.8,42.1 10.15,42.1 6.05,42.1 4.7,42.1 4.7,40.75 4.7,39.4
  pour Top: 0.4,43.6 0.4,38.35 2.4,38.35 3.3,37.45 3.3,33.35 5.05,33.35 5.05,36.85 10.4,36.85 10.4,39.75 12.05,39.75 12.05,42.45 9.5,45 6,45 4.6,43.6
  pour Bottom: 0.4,38.35 11.15,38.4 11.8,39.05 11.8,45 6,45 4.6,43.6 0.4,43.6
LED1
  Top 0.254: R1.1 92.25,48.19 LED1.A
LED2
  Top 0.254: R13.1 9.9,33.35 LED2.A
LED3
  Top 0.254: R14.1 9.9,20.65 LED3.A
N$2
  Top 0.254: IC2.8 79.62,17.39 80.88,18.65 82.6,18.65 Q3.IN
N$3
  Top 0.254: IC2.7 79.62,16.59 80.53,15.68 82.24,15.68 Q3.OUT
PB4-PWM  (via drill 0.5)
  Top 0.254: IC2.44 75.61,8.31 v75.6,8.3
  Bottom 0.254: J3.9 72.83,3.8 74.7,3.8 75.4,4.5 75.4,8.1 v75.6,8.3
PB5-MOSI
  Top 0.254: J2.4 88.97,2.53 87.7,3.8 86.35,3.8 78.36,11.79 IC2.1
PB6-MISO
  Top 0.254: J2.1 90.62,3.8 88.8,3.8 88.05,4.55 88.05,5.5 87.25,6.3 84.6,6.3 78.31,12.59 IC2.2
PB7-SCK
  Top 0.254: J2.3 87.57,6.85 84.85,6.85 78.31,13.38 IC2.3
PC0-SCL  (via drill 0.5)
  Top 0.254: v70.1,19.6 70.02,19.68 IC2.19
  Bottom 0.254: J3.1 80.88,5.07 76.2,9.75 71.35,9.75 68.65,12.45 68.65,16.5 68.95,16.8 68.95,18.45 v70.1,19.6
PC1-SDA  (via drill 0.5)
  Top 0.254: v68.8,19.6 69.22,20.02 IC2.20
  Bottom 0.254: J3.3 79.18,6.02 76,9.2 71.15,9.2 68.1,12.25 68.1,16.7 68.4,17 68.4,19.2 v68.8,19.6
PD2-RX1  (via drill 0.5)
  Top 0.254: IC2.11 77.42,20.61 v77.7,20.9
  Bottom 0.254: J3.5 77.91,3.8 82.1,3.8 82.9,4.6 82.9,5.6 77.4,11.1 77.4,20.6 v77.7,20.9
PD3-TX1  (via drill 0.5)
  Top 0.254: v74.1,7.8 74.5,7.4 76,7.4 76.5,7.9 76.5,10.7 75.72,11.48 75.72,12.98 74.78,13.93 74.78,15.07 75.61,15.91 IC2.12
  Bottom 0.254: J3.7 v74.1,7.8
USBDM
  Top 0.254: IC100.16 25.3,12.1 25.3,13.3 25.1,13.5 24.4,13.5 23.6,12.7 17.55,12.7 15.75,10.9 J1.D-
USBDP
  Top 0.254: IC100.15 24.64,12.09 24.65,12.15 17.75,12.15 17,11.4 17,10.15 J1.D+
X-DIR  (via drill 0.5)
  Top 0.254: IC2.24 64.42,18.98 v63.85,19.55
  Bottom 0.254: POLOLU-X.DIR 32.66,27.5 49.65,27.5 50.7,26.45 57.6,26.45 63.85,20.2 v63.85,19.55
X-MOT-1A
  Top 2.286: POLOLU-X.1A JP1.3
X-MOT-1B
  Top 2.286: POLOLU-X.1B JP1.4
X-MOT-2A
  Top 2.286: POLOLU-X.2A JP1.2
X-MOT-2B
  Top 2.286: POLOLU-X.2B JP1.1
X-MS1
  Top 0.254: SJ1.3 16.85,28.07 POLOLU-X.MS1 15.71,29.24 15.7,29.25 R2.1
X-MS2
  Top 0.254: SJ1.2 POLOLU-X.MS2
X-MS3
  Top 0.254: SJ1.1 19.65,28.07 POLOLU-X.MS3
X-RESETSLEEP
  Top 0.254: POLOLU-X.!RST POLOLU-X.!SLP
X-STEP  (via drill 0.5)
  Top 0.254: IC2.16 72.42,19.91 v72.45,19.85
  Bottom 0.254: POLOLU-X.STEP 29.55,30.35 31.5,30.35 32.2,29.65 32.2,28.8 32.95,28.05 34,28.05 34.75,28.8 34.75,29.55 35.55,30.35 72.1,30.35 72.75,29.7 72.75,28.6 72.1,27.95 72.1,20.2 v72.45,19.85
X-STOP
  Top 0.254: JP2.4 29.83,1.3 37.25,1.3 37.9,1.95 37.9,3.6 38.95,4.65 48.2,4.65 52.7,9.15 52.7,14 60.3,21.6 66,21.6 67.2,22.8 68.2,22.8 68.42,22.59 IC2.21
Y-DIR  (via drill 0.5)
  Top 0.254: IC2.26 61.22,17.39 v61.2,17.4
  Bottom 0.254: POLOLU-Y.DIR 52.93,27.55 58,27.55 65.35,20.2 65.35,18.85 63.85,17.35 61.25,17.35 v61.2,17.4
Y-MOT-1A
  Top 2.286: POLOLU-Y.1A JP3.3
Y-MOT-1B
  Top 2.286: POLOLU-Y.1B JP3.4
Y-MOT-2A
  Top 2.286: POLOLU-Y.2A JP3.2
Y-MOT-2B
  Top 2.286: POLOLU-Y.2B JP3.1
Y-MS1
  Top 0.254: SJ2.3 37.15,28.09 POLOLU-Y.MS1 36.03,29.23 36.05,29.25 R3.1
Y-MS2
  Top 0.254: SJ2.2 38.55,29.19 POLOLU-Y.MS2
Y-MS3
  Top 0.254: SJ2.1 39.95,28.05 POLOLU-Y.MS3
Y-RESETSLEEP
  Top 0.254: POLOLU-Y.!RST POLOLU-Y.!SLP
Y-STEP  (via drill 0.5)
  Top 0.254: IC2.25 63.27,18.18 v63.1,18.35
  Bottom 0.254: POLOLU-Y.STEP 50.94,27 57.8,27 64.8,20 64.8,19.15 64,18.35 v63.1,18.35
Y-STOP
  Top 0.254: JP4.4 42.43,4.1 48.4,4.1 53.25,8.95 53.25,13.8 60.5,21.05 67.05,21.05 IC2.22 | 67.55,22.2 67.6,22.15 IC2.22 | IC2.22 | IC2.22
Z-DIR  (via drill 0.5)
  Top 0.254: v71.7,14.8 73.45,14.8 73.65,14.6 73.65,13.5 74.6,12.55 74.6,11.6 74,11 IC2.42
  Bottom 0.254: POLOLU-Z.DIR 71.59,20.34 71.55,20.3 71.55,19.3 71.6,19.25 71.6,14.9 v71.7,14.8
Z-MOT-1A
  Top 2.286: POLOLU-Z.1A JP30.3 JP5.3
Z-MOT-1B
  Top 2.286: POLOLU-Z.1B JP30.4 JP5.4
Z-MOT-2A
  Top 2.286: POLOLU-Z.2A JP30.2 JP5.2
Z-MOT-2B
  Top 2.286: POLOLU-Z.2B JP30.1 JP5.1
Z-MS1
  Top 0.254: SJ3.3 57.5,28.06 POLOLU-Z.MS1 56.35,29.35 R4.1
Z-MS2
  Top 0.254: SJ3.2 POLOLU-Z.MS2
Z-MS3
  Top 0.254: SJ3.1 60.3,28.08 POLOLU-Z.MS3
Z-RESETSLEEP
  Top 0.254: POLOLU-Z.!RST POLOLU-Z.!SLP
Z-STEP  (via drill 0.5)
  Top 0.254: v70.45,15.35 70.85,15.75 73.3,15.75 74.2,14.85 74.2,13.75 75.15,12.8 75.15,11.3 74.8,10.95 IC2.43
  Bottom 0.254: POLOLU-Z.STEP 69.74,29.21 71,27.95 71,15.9 v70.45,15.35
Z-STOP
  Top 0.254: JP6.4 53.78,13.58 60.7,20.5 65.1,20.5 IC2.23 | IC2.23

### Text on the board
Top: Rettelser / Fjern thermal ved V-Reg.
_tsilk: X-MOTOR | Y-MOTOR | Z-MOTOR | E-MOTOR | POWER | 2B | 2A | 1A | 1B | 2B | 2A | 1A | 1B | 2B | 2A | 1A | 1B | PWR1/TIP | 2B | 2A | 1A | 1B | -V | VMOT | GND | 2B | 2A | 1A | 1B | VDD | GND | VMOT | GND | 2B | 2A | 1A | 1B | VDD | GND | VMOT | GND | 2B | 2A | 1A | 1B | VDD | GND | VMOT | GND | 2B | 2A | 1A | 1B | VDD | GND | +12V | PWR2/BED | !EN | MS1 | MS2 | MS3 | !RST | !SLP | STEP | DIR | !EN | MS1 | MS2 | MS3 | !RST | !SLP | STEP | DIR | !EN | MS1 | MS2 | MS3 | !RST | !SLP | STEP | DIR | !EN | MS1 | MS2 | MS3 | !RST | !SLP | STEP | DIR | -V | E-THERM | +12V | MS1 | MS2 | MS3 | MS1 | MS2 | MS3 | MS1 | MS2 | MS3 | MS1 | MS2 | MS3 | B-THERM | GND 12V | . | reprap.org/wiki/sanguinololu | www.reprap.me | . | RESET | X-STOP | Y-STOP | Z-STOP | EXT V2 | PWM | TX1 | RX1 | SDA | SCL | 12V | 5V | D12 | D11 | D10 | D17 | D16 | !RESET | SCK | MISO | SIG | GND | +V | SIG | GND | +V | SIG | GND | +V | ISP/SPI | Sanguinololu | Rev 1.3b | GND | GND | A4 | A3 | A2 | A1 | A0 | GND | MOSI | 5V | DSan1.3b_5x10
_bsilk: X-MOTOR | Y-MOTOR | Z-MOTOR | E-MOTOR | 2B | 2A | 1A | 1B | 2B | 2A | 1A | 1B | 2B | 2A | 1A | 1B | 2B | 2A | 1A | 1B | -V | PWR1/TIP | +12V | -V | PWR2/BED | E-THERM | +12V | B-THERM | reprap.org/wiki/sanguinololu | GND 12V | www.reprap.me | PWM | TX1 | RX1 | SDA | SCL | 12V | 5V | D12 | D11 | D10 | D17 | D16 | !RESET | SCK | MISO | SIG | GND | +V | SIG | GND | +V | SIG | GND | +V | X-STOP | Y-STOP | Z-STOP | ISP/SPI | GND | GND | A4 | A3 | A2 | A1 | A0 | GND | MOSI | 5V